# Altium schematic sheet DrudePower.SchDoc
size Letter
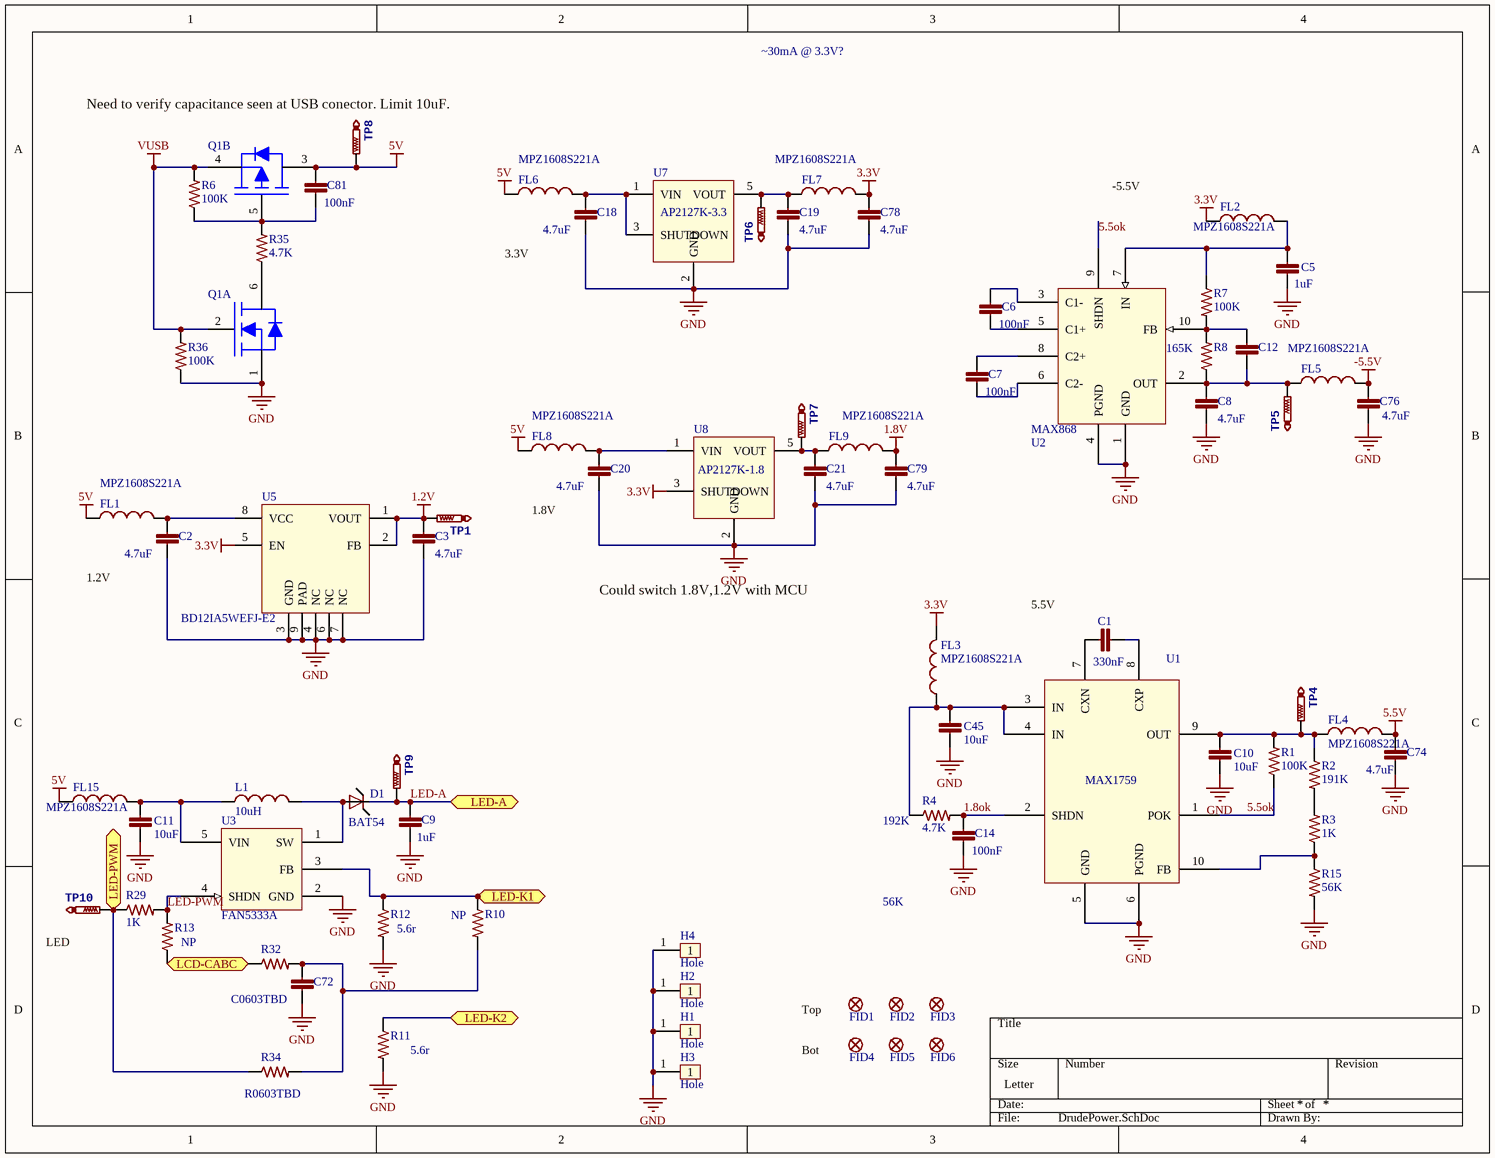
[diagram p0: DrudePower.SchDoc]

## Parts
C1  330nF  [C0603]
C2  4.7uF  [C0603]
C3  4.7uF  [C0603]
C5  1uF  [C0603]
C6  100nF  [C0603]
C7  100nF  [C0603]
C8  4.7uF  [C0603]
C9  1uF  [C0805]
C10  10uF  [C0805]
C11  10uF  [C0805]
C12  (no value)  [C0603]
C14  100nF  [C0603]
C18  4.7uF  [C0603]
C19  4.7uF  [C0603]
C20  4.7uF  [C0603]
C21  4.7uF  [C0603]
C45  10uF  [C0805]
C72  C0603TBD  [C0603]
C74  4.7uF  [C0603]
C76  4.7uF  [C0603]
C78  4.7uF  [C0603]
C79  4.7uF  [C0603]
C81  100nF  [C0402]
D1  BAT54  [SOD523]
FID1  FIDUCIAL  [FIDUCIAL-1X2]  (value not drawn)
FID2  FIDUCIAL  [FIDUCIAL-1X2]  (value not drawn)
FID3  FIDUCIAL  [FIDUCIAL-1X2]  (value not drawn)
FID4  FIDUCIAL  [FIDUCIAL-1X2]  (value not drawn)
FID5  FIDUCIAL  [FIDUCIAL-1X2]  (value not drawn)
FID6  FIDUCIAL  [FIDUCIAL-1X2]  (value not drawn)
FL1  MPZ1608S221A  [C0603]
FL2  MPZ1608S221A  [C0603]
FL3  MPZ1608S221A  [C0603]
FL4  MPZ1608S221A  [C0603]
FL5  MPZ1608S221A  [C0603]
FL6  MPZ1608S221A  [C0603]
FL7  MPZ1608S221A  [C0603]
FL8  MPZ1608S221A  [C0603]
FL9  MPZ1608S221A  [C0603]
FL15  MPZ1608S221A  [C0603]
H1  Hole  [Standoff3mm]  (no BOM)
H2  Hole  [Standoff3mm]  (no BOM)
H3  Hole  [Standoff3mm]  (no BOM)
H4  Hole  [Standoff3mm]  (no BOM)
L1  10uH  [INDP3027X15L]
Q1  DMC2400UV  [SOT563-FL50P162X170-6N]  (value not drawn)  (parts A,B of 2)
R1  100K  [R0603]
R2  191K  [R0603]
R3  1K  [R0603]
R4  4.7K  [R0603]
R6  100K  [R0402]
R7  100K  [R0402]
R8  165K  [R0402]
R10  (no value)  [R0603]
R11  (no value)  [R0603]
R12  (no value)  [R0603]
R13  (no value)  [R0603]
R15  56K  [R0603]
R29  1K  [R0603]
R32  (no value)  [R0603]
R34  R0603TBD  [R0603]
R35  4.7K  [R0603]
R36  100K  [R0402]
TP1  TestPoint  [TP1-27]  (value not drawn)  (no BOM)
TP4  TestPoint  [TP1-27]  (value not drawn)  (no BOM)
TP5  TestPoint  [TP1-27]  (value not drawn)  (no BOM)
TP6  TestPoint  [TP1-27]  (value not drawn)  (no BOM)
TP7  TestPoint  [TP1-27]  (value not drawn)  (no BOM)
TP8  TestPoint  [TP1-27]  (value not drawn)  (no BOM)
TP9  TestPoint  [TP1-27]  (value not drawn)  (no BOM)
TP10  TestPoint  [TP1-27]  (value not drawn)  (no BOM)
U1  MAX1759  [TSSOP50P490X109-10L]
U2  MAX868  [TSSOP50P490X109-10L]
U3  FAN5333A  [SOT95P270X145-5L]
U5  BD12IA5WEFJ-E2  [TSOP-HTSOP-J8-127P600X100_HS-9M]
U7  AP2127K-3.3  [SOT23-5P285X140-5L]
U8  AP2127K-1.8  [SOT23-5P285X140-5L]

## Ports
LCD-CABC, LED-A, LED-K1, LED-K2, LED-PWM

## Nets
1.2V: C3.1 TP1.TP U5.1(VOUT) U5.2(FB)
1.8V: C79.1 FL9.2
3.3V: C78.1 FL2.1 FL3.2 FL7.2 U5.5(EN) U8.3(SHUTDOWN)
5.5V: C74.1 FL4.2
5V: C81.1 FL1.1 FL6.1 FL8.1 FL15.1 Q1.3(D2) TP8.TP
-5.5V: C76.1 FL5.2
GND: C2.2 C3.2 C5.2 C8.2 C9.2 C10.2 C11.2 C14.2 C18.2 C19.2 C20.2 C21.2 C45.2 C72.2 C74.2 C76.2 C78.2 C79.2 H1.1 H2.1 H3.1 H4.1 Q1.1(S1) R11.2 R12.2 R15.2 R36.1 U1.5(GND) U1.6(PGND) U2.1(GND) U2.4(PGND) U3.2(GND) U5.3(GND) U5.4(NC) U5.6(NC) U5.7(NC) U5.9(PAD) U7.2(GND) U8.2(GND)
VUSB: Q1.2(G1) Q1.4(S2) R6.2 R36.2
1.8ok: C14.1 R4.2 U1.2(SHDN)
5.5ok: R1.1 U1.1(POK) U2.9(SHDN)
LCD-CABC: R13.1 R32.1 ; port LCD-CABC
LED-A: C9.1 D1.C TP9.TP ; port LED-A
LED-K1: R10.1 R12.1 U3.3(FB) ; port LED-K1
LED-K2: R11.1 ; port LED-K2
LED-PWM: R13.2 R29.2 U3.4(SHDN)
LED-PWM: R29.1 R34.1 TP10.TP ; port LED-PWM  [a separate net that carries the same name]
NetC1_1: C1.1 U1.7(CXN)
NetC1_2: C1.2 U1.8(CXP)
NetC2_1: C2.1 FL1.2 U5.8(VCC)
NetC5_1: C5.1 FL2.2 R7.1 U2.7(IN)
NetC6_1: C6.1 U2.3(C1-)
NetC6_2: C6.2 U2.5(C1+)
NetC7_1: C7.1 U2.8(C2+)
NetC7_2: C7.2 U2.6(C2-)
NetC8_1: C8.1 C12.2 FL5.1 R8.1 TP5.TP U2.2(OUT)
NetC10_1: C10.1 FL4.1 R1.2 R2.1 TP4.TP U1.9(OUT)
NetC11_1: C11.1 FL15.2 L1.1 U3.5(VIN)
NetC12_1: C12.1 R7.2 R8.2 U2.10(FB)
NetC18_1: C18.1 FL6.2 U7.1(VIN) U7.3(SHUTDOWN)
NetC19_1: C19.1 FL7.1 TP6.TP U7.5(VOUT)
NetC20_1: C20.1 FL8.2 U8.1(VIN)
NetC21_1: C21.1 FL9.1 TP7.TP U8.5(VOUT)
NetC45_1: C45.1 FL3.1 R4.1 U1.3(IN) U1.4(IN)
NetC72_1: C72.1 R10.2 R32.2 R34.2
NetC81_2: C81.2 Q1.5(G2) R6.1 R35.2
NetD1_A: D1.A L1.2 U3.1(SW)
NetQ1_6: Q1.6(D1) R35.1
NetR2_2: R2.2 R3.2
NetR3_1: R3.1 R15.1 U1.10(FB)

## Notes on the sheet
- ~30mA @ 3.3V?
- Need to verify capacitance seen at USB conector. Limit 10uF.
- -5.5V
- 3.3V
- 1.8V
- 1.2V
- Could switch 1.8V,1.2V with MCU
- 5.5V
- (near R4) 192K
- 56K
- LED
- (near R13) NP
- (near R12) 5.6r
- (near R10) NP
- Top
- (near R11) 5.6r
- Bot

## Library data of the parts
C1 = C1608X7R1H334K080AC: CAP CER 0603 330nF 50V 10% X7R; LastRevisionNote: ImportComponents; Published: 23-Apr-2014; Publisher: UltiMachine; LastRevisionDate: 23-Apr-2014; ManufacturerPartNumber: C1608X7R1H334K080AC; VALUE: 330nF
C2 C3 C8 C18-C21 C74 C76 C78 C79 = GRM188R61A475KE15D: CAP CER 4.7UF 10V X5R 0603; LastRevisionNote: ImportComponents; Published: 23-Apr-2014; Publisher: UltiMachine; LastRevisionDate: 23-Apr-2014; ManufacturerPartNumber: GRM188R61A475KE15D; VALUE: 4.7uF
C5 = CC0603ZRY5V6BB105: CAP CER 0603 1uF 10V Y5V; LastRevisionNote: ImportComponents; Published: 23-Apr-2014; Publisher: UltiMachine; LastRevisionDate: 23-Apr-2014; ManufacturerPartNumber: CC0603ZRY5V6BB105; VALUE: 1uF
C6 C7 C14 = C0603C104K5RACTU: CAP CER 0603 100nF 50V 10% X7R; LastRevisionNote: ImportComponents; Published: 23-Apr-2014; Publisher: UltiMachine; LastRevisionDate: 23-Apr-2014; ManufacturerPartNumber: C0603C104K5RACTU; VALUE: 100nF
C9 = GRM21BR71H105KA12L: CAP CER 0805 1uF 50V 10% X7R; LastRevisionNote: ImportComponents; Published: 23-Apr-2014; Publisher: UltiMachine; LastRevisionDate: 23-Apr-2014; ManufacturerPartNumber: GRM21BR71H105KA12L; VALUE: 1uF
C10 C11 C45 = C0805C106K8PACTU: CAP CER 0805 10uF 10V 10% X5R; LastRevisionNote: ImportComponents; Published: 23-Apr-2014; Publisher: UltiMachine; LastRevisionDate: 23-Apr-2014; ManufacturerPartNumber: C0805C106K8PACTU; VALUE: 10uF
C12 = Capacitor: Capacitor Non Polarized; LastRevisionNote: ImportComponents; Published: 23-Apr-2014; Publisher: UltiMachine; LastRevisionDate: 23-Apr-2014
C72 = C0603TBD: Capacitor Non Polarized; LastRevisionNote: ImportComponents; Published: 23-Apr-2014; Publisher: UltiMachine; LastRevisionDate: 23-Apr-2014; VALUE: C0603TBD
C81 = GRM155R71C104KA88D: CAP CER 0402 100nF 16V 10% X7R; LastRevisionNote: ImportComponents; Published: 23-Apr-2014; Publisher: UltiMachine; LastRevisionDate: 23-Apr-2014; ManufacturerPartNumber: GRM155R71C104KA88D; VALUE: 100nF
D1 = BAT54XV2: Diode Schottky 30V 200mA
FID1-FID6 = FIDUCIAL: LastRevisionNote: ImportComponents; Published: 23-Apr-2014; Publisher: UltiMachine; LastRevisionDate: 23-Apr-2014
FL1-FL9 FL15 = MPZ1608S221A: Ferrite; LastRevisionNote: ImportComponents; Published: 23-Apr-2014; Publisher: UltiMachine; LastRevisionDate: 23-Apr-2014; Value: MPZ1608S221A
H1-H4 = Standoff3mm: Mechanical - Top connect
L1 = SRN3015-100M: Ind 10uH 1A
Q1 = DMC2400UV: Mosfet Complementary Pair N +P
R1 = RC0603FR-07100KL: RES 100K OHM 1/10W 1% 0603 SMD; LastRevisionNote: ImportComponents; Published: 23-Apr-2014; Publisher: UltiMachine; LastRevisionDate: 23-Apr-2014; ManufacturerPartNumber: RC0603FR-07100KL; VALUE: 100K
R2 = RC0603FR-07191KL: RES 191K OHM 1% 1/10W 0603 SMD; LastRevisionNote: ImportComponents; Published: 23-Apr-2014; Publisher: UltiMachine; LastRevisionDate: 23-Apr-2014; ManufacturerPartNumber: RC0603FR-07191KL; VALUE: 191K
R3 R29 = ERJ-3EKF1001V: RES 0603 1K 100mW 1%; LastRevisionNote: ImportComponents; Published: 23-Apr-2014; Publisher: UltiMachine; LastRevisionDate: 23-Apr-2014; ManufacturerPartNumber: ERJ-3EKF1001V; VALUE: 1K
R4 R35 = ERJ3EKF4701V: RES 0603 4.7K 100mW 1%; LastRevisionNote: ImportComponents; Published: 23-Apr-2014; Publisher: UltiMachine; LastRevisionDate: 23-Apr-2014; ManufacturerPartNumber: ERJ3EKF4701V; VALUE: 4.7K
R6 R7 R36 = RC0402FR-07100KL: RES 100K OHM 1% 1/16W 0402; LastRevisionNote: ImportComponents; Published: 23-Apr-2014; Publisher: UltiMachine; LastRevisionDate: 23-Apr-2014; VALUE: 100K
R8 = CRCW0402165KFKED: RES 165K OHM 1% 1/16W 0402; LastRevisionNote: ImportComponents; Published: 23-Apr-2014; Publisher: UltiMachine; LastRevisionDate: 23-Apr-2014; VALUE: 165K
R10-R13 R32 = Resistor: LastRevisionNote: ImportComponents; Published: 23-Apr-2014; Publisher: UltiMachine; LastRevisionDate: 23-Apr-2014
R15 = RC0603FR-0756KL: RES 56K OHM 1% 1/10W 0603 56K; LastRevisionNote: ImportComponents; Published: 23-Apr-2014; Publisher: UltiMachine; LastRevisionDate: 23-Apr-2014; ManufacturerPartNumber: RC0603FR-0756KL; VALUE: 56K
R34 = R0603TBD: Resistor; LastRevisionNote: ImportComponents; Published: 23-Apr-2014; Publisher: UltiMachine; LastRevisionDate: 23-Apr-2014; VALUE: R0603TBD
TP1 TP4-TP10 = TestPoint: Test Point; LastRevisionNote: ImportComponents; Published: 23-Apr-2014; Publisher: UltiMachine; LastRevisionDate: 23-Apr-2014
U1 = MAX1759: Buck/Boost Regulating Charge Pump
U2 = MAX868: Regulated -2x Inverting Charge Pump
U3 = FAN5333: LED Driver w/ integrated switch
U5 = BD12IA5WEFJ-E2: LDO Regulator 500mA 1.2V
U7 = AP2127K-3.3TRG1: LDO 3.3V 0.3A SOT25
U8 = AP2127K-1.8TRG1: LDO 1.8V 0.3A SOT25